# EAGLE schematic PROFET+_24V_Shield_wo_OL_V1.2 (EAGLE 6.2)
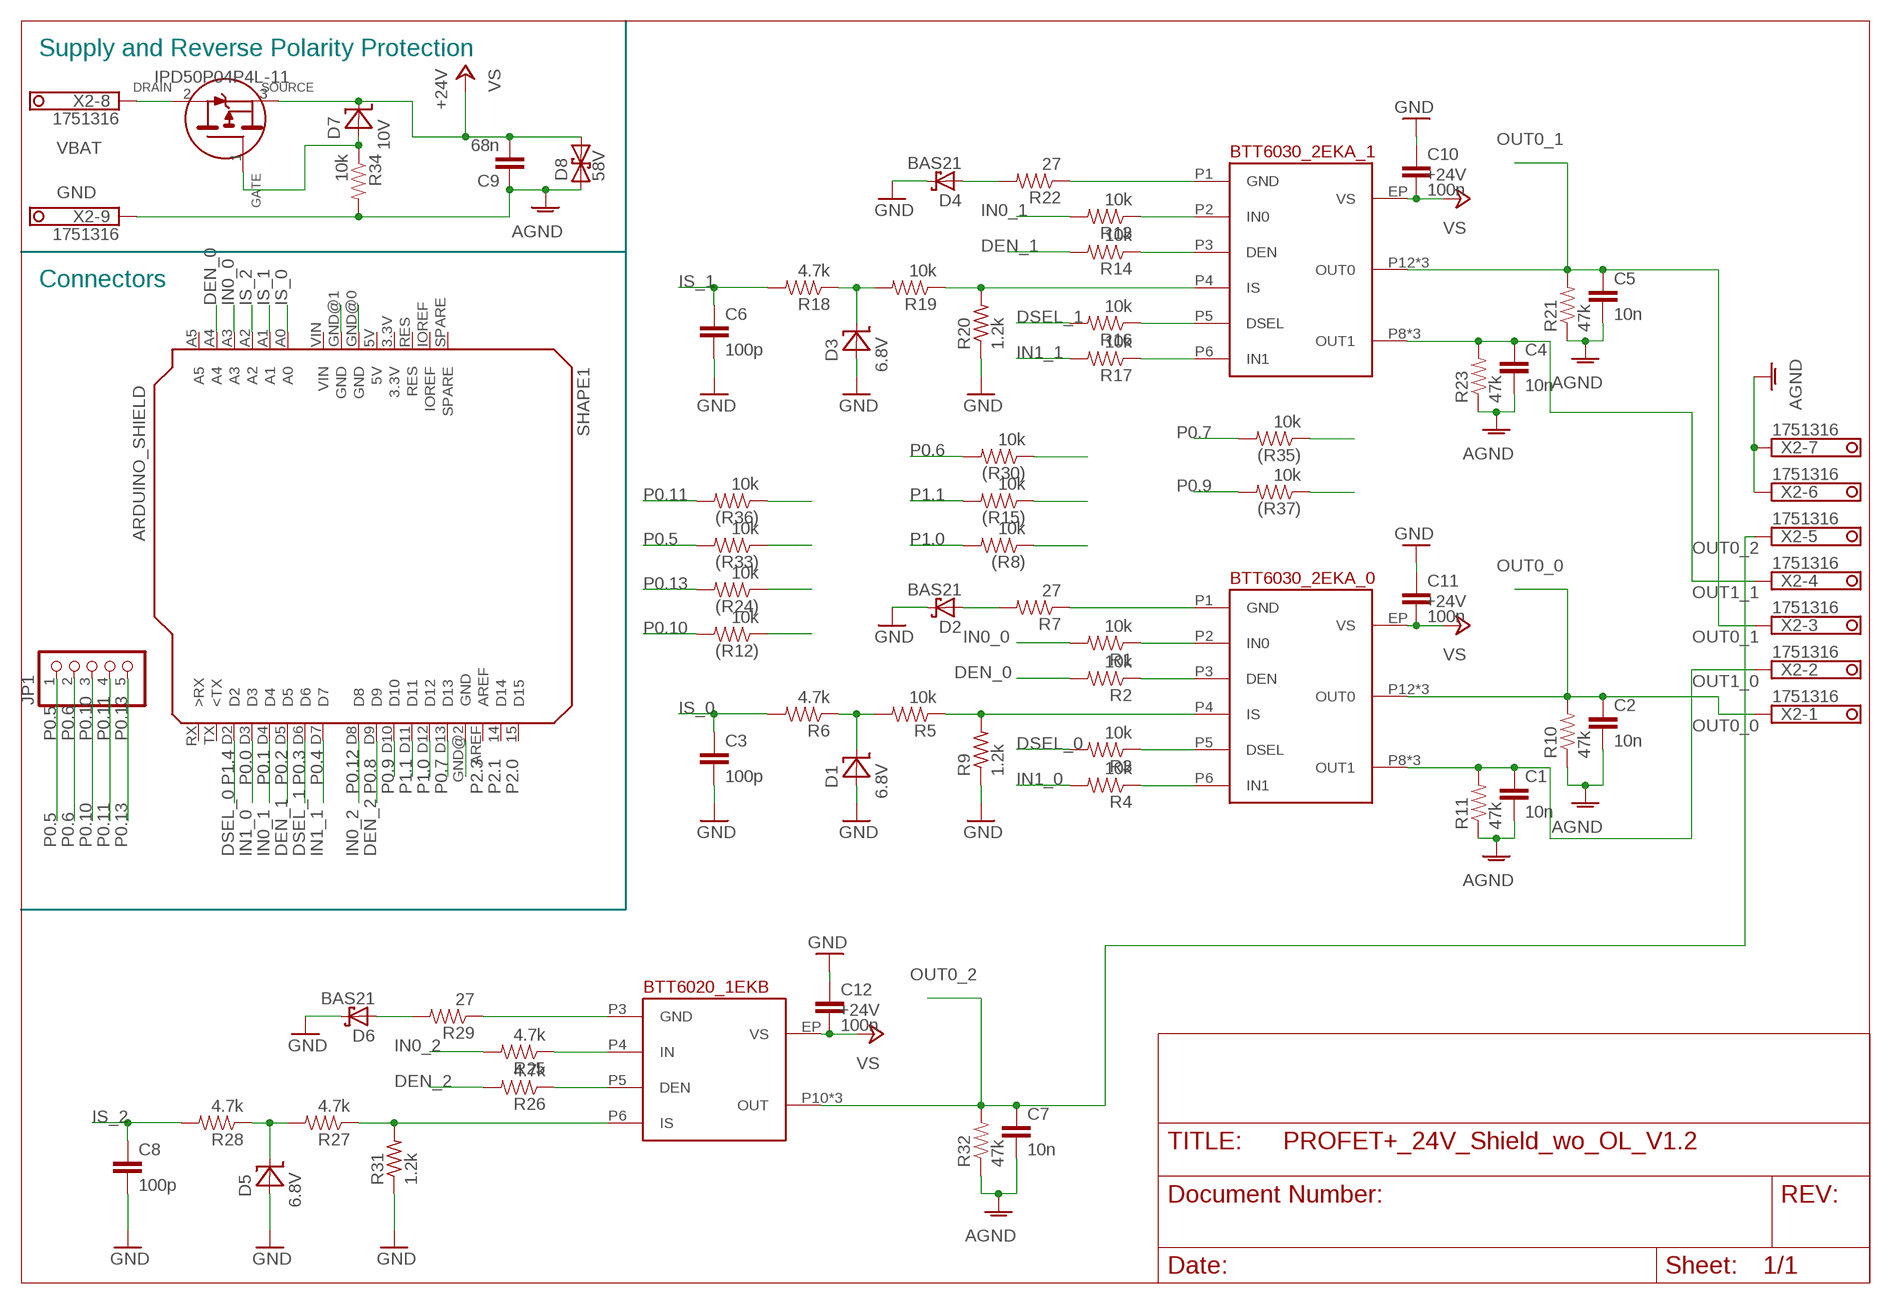
[diagram p0: schematic, sheet 1]

## Parts
(R8)  10k  RESISTOR0603-RES  [0603-RES]
(R12)  10k  RESISTOR0603-RES  [0603-RES]
(R15)  10k  RESISTOR0603-RES  [0603-RES]
(R24)  10k  RESISTOR0603-RES  [0603-RES]
(R30)  10k  RESISTOR0603-RES  [0603-RES]
(R33)  10k  RESISTOR0603-RES  [0603-RES]
(R35)  10k  RESISTOR0603-RES  [0603-RES]
(R36)  10k  RESISTOR0603-RES  [0603-RES]
(R37)  10k  RESISTOR0603-RES  [0603-RES]
BTT6020_1EKB  INFINEON_BTS5008-1EKB_2  INFINEON_BTS5008-1EKB  [IFX_PG_DSO_14_47_EP]
BTT6030_2EKA_0  INFINEON_BTS5020-2EKA  [IFX_PG_DSO_14_40_EP]
BTT6030_2EKA_1  INFINEON_BTS5020-2EKA  [IFX_PG_DSO_14_40_EP]
C1  10n  CAP0603-CAP  [0603-CAP]
C2  10n  CAP0603-CAP  [0603-CAP]
C3  100p  CAP0603-CAP  [0603-CAP]
C4  10n  CAP0603-CAP  [0603-CAP]
C5  10n  CAP0603-CAP  [0603-CAP]
C6  100p  CAP0603-CAP  [0603-CAP]
C7  10n  CAP0603-CAP  [0603-CAP]
C8  100p  CAP0603-CAP  [0603-CAP]
C9  68n  CAP0603-CAP  [0603-CAP]
C10  100n  CAP0603-CAP  [0603-CAP]
C11  100n  CAP0603-CAP  [0603-CAP]
C12  100n  CAP0603-CAP  [0603-CAP]
D1  6.8V  SMD-PACKAGES_ZMM  [SMD-PACKAGES_SOD80]
D2  BAS21  BAS40  [SOT23]
D3  6.8V  SMD-PACKAGES_ZMM  [SMD-PACKAGES_SOD80]
D4  BAS21  BAS40  [SOT23]
D5  6.8V  SMD-PACKAGES_ZMM  [SMD-PACKAGES_SOD80]
D6  BAS21  BAS40  [SOT23]
D7  10V  SMD-PACKAGES_ZMM  [SMD-PACKAGES_SOD80]
D8  58V  SUPPRESSER_SMA_SMB_SMC  [SMA]
IPD50P04P4L  INF-PG-TO252-3-313_L_1  [INF-PG-TO252-3-313_L_1PRIMARY]
JP1  PINHD-1X5  [1X05]
R1  10k  RESISTOR0603-RES  [0603-RES]
R2  10k  RESISTOR0603-RES  [0603-RES]
R3  10k  RESISTOR0603-RES  [0603-RES]
R4  10k  RESISTOR0603-RES  [0603-RES]
R5  10k  RESISTOR0603-RES  [0603-RES]
R6  4.7k  RESISTOR0603-RES  [0603-RES]
R7  27  RESISTOR0603-RES  [0603-RES]
R9  1.2k  R-US_R1206  [R1206]
R10  47k  RESISTOR0603-RES  [0603-RES]
R11  47k  RESISTOR0603-RES  [0603-RES]
R13  10k  RESISTOR0603-RES  [0603-RES]
R14  10k  RESISTOR0603-RES  [0603-RES]
R16  10k  RESISTOR0603-RES  [0603-RES]
R17  10k  RESISTOR0603-RES  [0603-RES]
R18  4.7k  RESISTOR0603-RES  [0603-RES]
R19  10k  RESISTOR0603-RES  [0603-RES]
R20  1.2k  R-US_R1206  [R1206]
R21  47k  RESISTOR0603-RES  [0603-RES]
R22  27  RESISTOR0603-RES  [0603-RES]
R23  47k  RESISTOR0603-RES  [0603-RES]
R25  4.7k  RESISTOR0603-RES  [0603-RES]
R26  4.7k  RESISTOR0603-RES  [0603-RES]
R27  4.7k  RESISTOR0603-RES  [0603-RES]
R28  4.7k  RESISTOR0603-RES  [0603-RES]
R29  27  RESISTOR0603-RES  [0603-RES]
R31  1.2k  R-US_R1206  [R1206]
R32  47k  RESISTOR0603-RES  [0603-RES]
R34  10k  RESISTOR0603-RES  [0603-RES]
SHAPE1  ARDUINO_SHIELD  [XMC1100_FOR_ARDUINO]
X2  1751316  [1751316]

## Nets
DEN_0: R2.2 SHAPE1.A4
DEN_1: R14.2 SHAPE1.D5
DEN_2: R26.2 SHAPE1.D9
DSEL_0: R3.2 SHAPE1.D2
DSEL_1: R16.2 SHAPE1.D6
GND: C1.2 C2.2 C3.2 C4.2 C5.2 C6.2 C7.2 C8.2 C9.1 C10.1 C11.1 C12.1 D1.A D2.3(C) D3.A D4.3(C) D5.A D6.3(C) D8.A R9.1 R10.1 R11.1 R20.1 R21.1 R23.1 R31.1 R32.1 R34.2 SHAPE1.GND@0(GND) SHAPE1.GND@1(GND) SHAPE1.GND@2(GND) X2.6 X2.7 X2.9 ; supply symbol labelled AGND
IN0_0: R1.2 SHAPE1.A3
IN0_1: R13.2 SHAPE1.D4
IN0_2: R25.2 SHAPE1.D8
IN1_0: R4.2 SHAPE1.D3
IN1_1: R17.2 SHAPE1.D7
IS_0: C3.1 R6.2 SHAPE1.A0
IS_1: C6.1 R18.2 SHAPE1.A1
IS_2: C8.1 R28.2 SHAPE1.A2
N$1: BTT6030_2EKA_1.P5(DSEL) R16.1
N$2: (R12).1
N$3: D7.A IPD50P04P4L.1(GATE_PIN1) R34.1
N$4: BTT6030_2EKA_1.P6(IN1) R17.1
N$5: BTT6030_2EKA_1.P3(DEN) R14.1
N$6: D2.1(A) R7.2
N$7: BTT6030_2EKA_1.P2(IN0) R13.1
N$8: BTT6030_2EKA_1.P1(GND) R22.1
N$9: BTT6030_2EKA_1.P4(IS) R19.1 R20.2
N$10: D4.1(A) R22.2
N$11: D3.K(C) R18.1 R19.2
N$12: BTT6030_2EKA_0.P5(DSEL) R3.1
N$13: BTT6030_2EKA_0.P6(IN1) R4.1
N$14: BTT6030_2EKA_0.P3(DEN) R2.1
N$15: BTT6030_2EKA_0.P2(IN0) R1.1
N$16: BTT6030_2EKA_0.P1(GND) R7.1
N$17: BTT6030_2EKA_0.P4(IS) R5.1 R9.2
N$18: (R37).1
N$19: D1.K(C) R5.2 R6.1
N$20: (R36).1
N$21: (R24).1
N$22: (R15).1
N$23: (R30).1
N$24: BTT6020_1EKB.P5(DEN) R26.1
N$25: BTT6020_1EKB.P4(IN) R25.1
N$26: BTT6020_1EKB.P3(GND) R29.1
N$27: BTT6020_1EKB.P6(IS) R27.1 R31.2
N$28: D6.1(A) R29.2
N$29: D5.K(C) R27.2 R28.1
N$31: (R33).1
N$33: (R8).1
N$34: (R35).1
OUT0_0: BTT6030_2EKA_0.P12(OUT0) BTT6030_2EKA_0.P13(OUT0) BTT6030_2EKA_0.P14(OUT0) C2.1 R10.2 X2.1
OUT0_1: BTT6030_2EKA_1.P12(OUT0) BTT6030_2EKA_1.P13(OUT0) BTT6030_2EKA_1.P14(OUT0) C5.1 R21.2 X2.3
OUT0_2: BTT6020_1EKB.P10(OUT) BTT6020_1EKB.P11(OUT) BTT6020_1EKB.P12(OUT) C7.1 R32.2 X2.5
OUT1_0: BTT6030_2EKA_0.P8(OUT1) BTT6030_2EKA_0.P9(OUT1) BTT6030_2EKA_0.P10(OUT1) C1.1 R11.2 X2.2
OUT1_1: BTT6030_2EKA_1.P8(OUT1) BTT6030_2EKA_1.P9(OUT1) BTT6030_2EKA_1.P10(OUT1) C4.1 R23.2 X2.4
P0.5: (R33).2 JP1.1
P0.6: (R30).2 JP1.2
P0.7: (R35).2 SHAPE1.D13
P0.9: (R37).2 SHAPE1.D10
P0.10: (R12).2 JP1.3
P0.11: (R36).2 JP1.4
P0.13: (R24).2 JP1.5
P1.0: (R8).2 SHAPE1.D12
P1.1: (R15).2 SHAPE1.D11
VBAT: IPD50P04P4L.2(DRAIN_PIN2) X2.8
VS: BTT6020_1EKB.EP(VS) BTT6030_2EKA_0.EP(VS) BTT6030_2EKA_1.EP(VS) C9.2 C10.2 C11.2 C12.2 D7.K(C) D8.C IPD50P04P4L.3(SOURCE_PIN3) ; supply symbol labelled +24V
Unconnected: SHAPE1.3.3V SHAPE1.5V SHAPE1.14(D14) SHAPE1.15(D15) SHAPE1.A5 SHAPE1.AREF SHAPE1.IOREF SHAPE1.RES SHAPE1.RX(>RX) SHAPE1.SPARE SHAPE1.TX(<TX) SHAPE1.VIN

## Notes on the sheet
- Supply and Reverse Polarity Protection
- Connectors
- P0.5 | P0.6 | P0.10 | P0.11 | P0.13
- P1.4 | P0.0 | P0.1 | P0.2 | P0.3 | P0.4
- P0.12 | P0.8 | P0.9 | P1.1 | P1.0 | P0.7 | P2.3 | P2.1 | P2.0

## Library data of the parts
(R8) (R12) (R15) (R24) (R30) (R33) (R35) (R36) (R37) R1-R7 R10 R11 R13 R14 R16-R19 R21-R23 R25-R29 R32 R34 = SparkFun:RESISTOR: Resistor Basic schematic elements and footprints for 0603, 1206, and PTH 1/10th watt (small) resistors.
BTT6020_1EKB = PROFET+_EAGLE_Library:INFINEON_BTS5008-1EKB: PROFET+ 12V BTS5008-1EKB Smart High-Side Power Switch Single Channel, 8mOhm
BTT6030_2EKA_0 BTT6030_2EKA_1 = PROFET+_EAGLE_Library:INFINEON_BTS5020-2EKA: PROFET+ 12V BTS5020-2EKA Smart High-Side Power Switch Dual Channel, 20mOhm
C1-C12 = SparkFun:CAP: Capacitor Standard 0603 ceramic capacitor, and 0.1" leaded capacitor.
D1 D3 D5 D7 = NovalithIC_H-Bridge_Demo_Board_V2_2:SMD-PACKAGES_ZMM: Werte: 1V, 2,7V ...51V Reihe E24
D2 D4 D6 = diode:BAS40: Silicon Schottky Diodes General-purpose diode for high-speed switching
D8 = diode_suppressor_smc:SUPPRESSER_SMA_SMB_SMC
IPD50P04P4L = IPD50P04P4L-11:INF-PG-TO252-3-313_L_1
JP1 = pinhead:PINHD-1X5: PIN HEADER
R9 R20 R31 = resistor:R-US_: RESISTOR, American symbol
SHAPE1 = arduino:ARDUINO_SHIELD
X2 = con-phoenix-350:1751316: MKDS 1/ 9-3,5 Printklemme Nennstrom: 10 A Bemessungsspannung: 160 V Raster: 3,5 mm Polzahl: 9 Montageart: Löten Anschlussart: Schraubanschluss Anschlussrichtung vom Leiter zur Platine: 0° Source: http://eshop.phoenixcontact.com .. 1751316.pdf; OC_FARNELL: unknown; OC_NEWARK: unknown